# EAGLE design PR9014 (EAGLE 7.2.0)
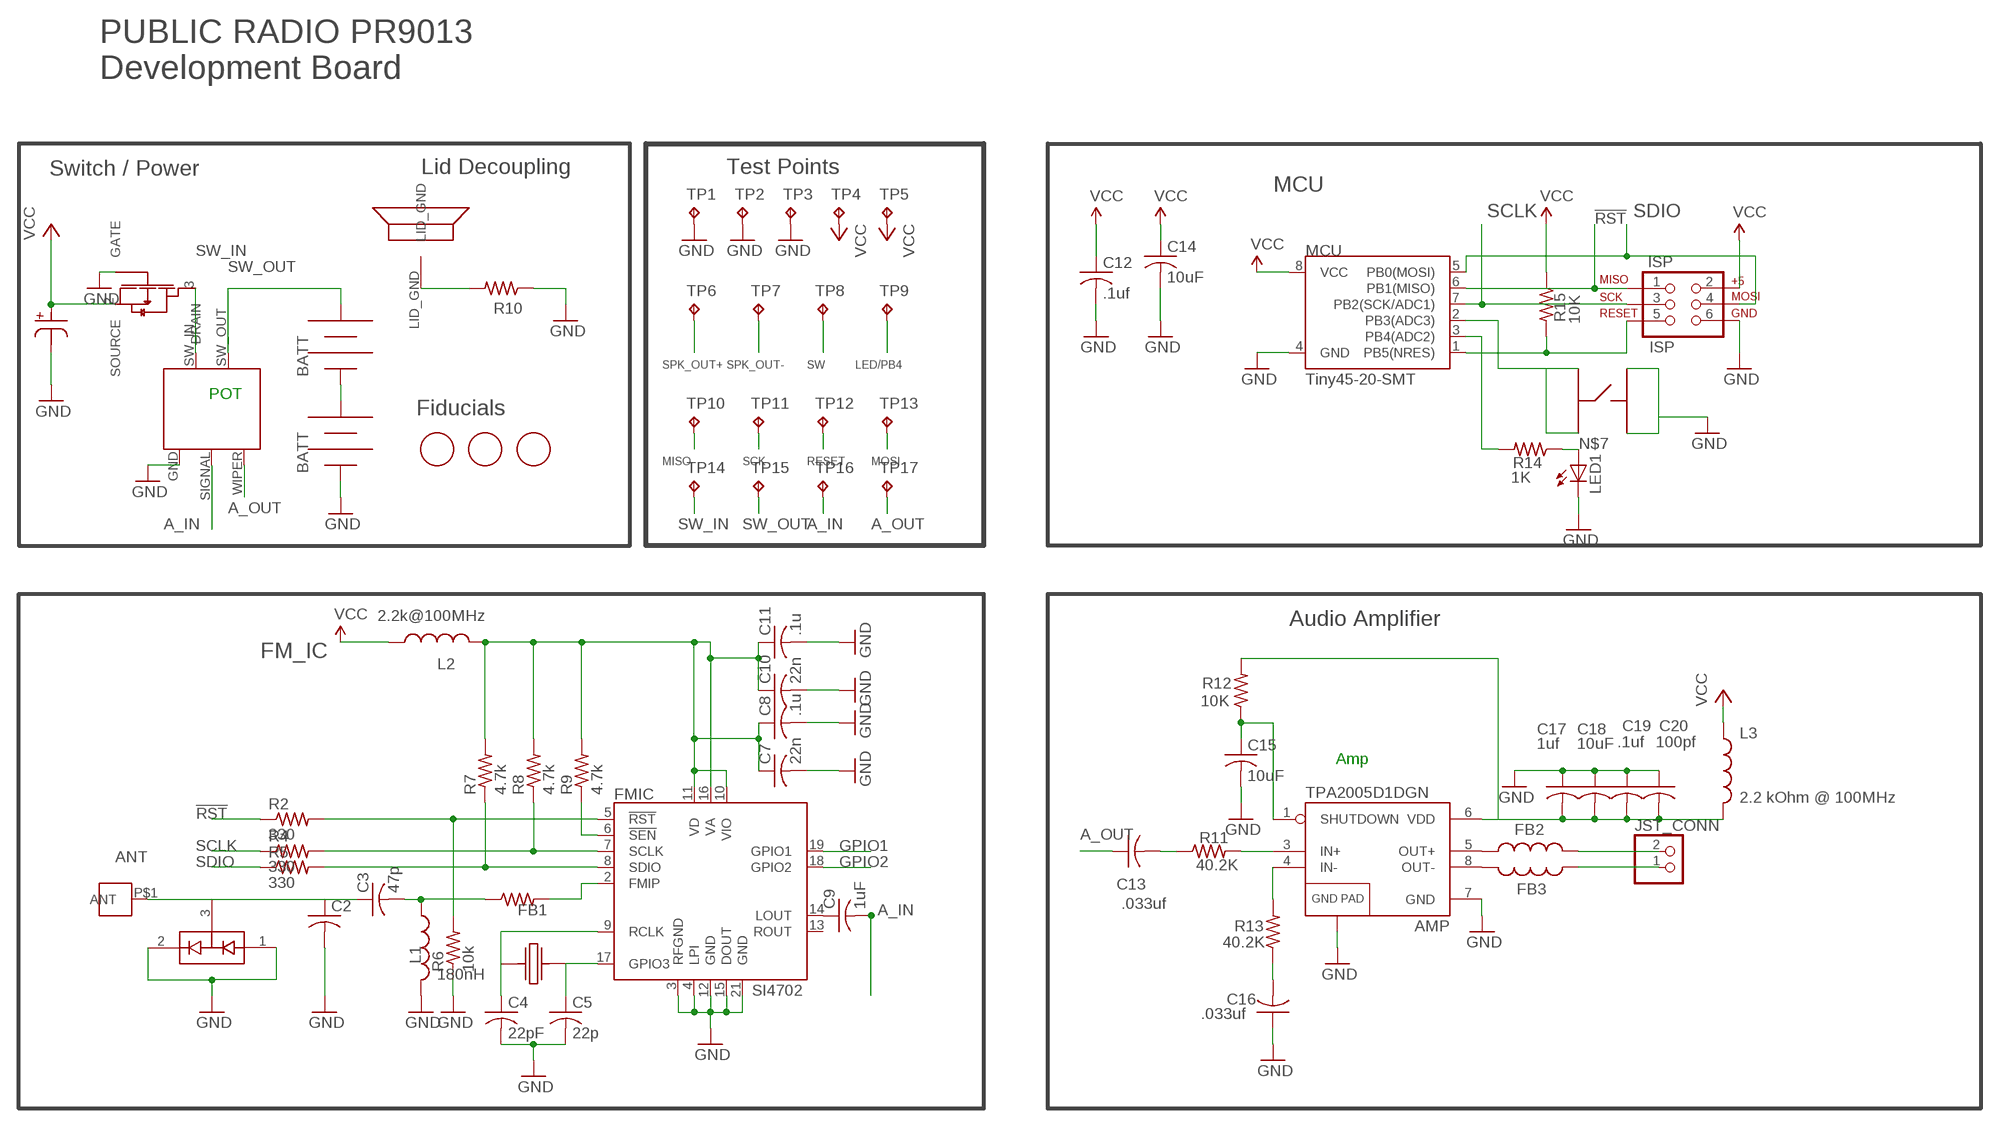
[diagram p0: schematic, sheet 1]

## Parts
AMP  TPA2005D1DGN  [POWER-SOP8]
C1  220uF  NICHICON_SERIESUD  [NICHICON_SERIESUD]
C2  C-USC0402  [C0402]
C3  47p  C-USC0402  [C0402]
C4  22pF  C-USC0402  [C0402]
C5  22p  C-USC0402  [C0402]
C7  22n  C-USC0402  [C0402]
C8  .1u  C-USC0402  [C0402]
C9  1uF  C-USC0402  [C0402]
C10  22n  C-USC0402  [C0402]
C11  .1u  C-USC0402  [C0402]
C12  .1uf  C-USC0402  [C0402]
C13  .033uf  C-USC0402  [C0402]
C14  10uF  C-USC0603  [C0603]
C15  10uF  C-USC0603  [C0603]
C16  .033uf  C-USC0402  [C0402]
C17  1uf  C-USC0402  [C0402]
C18  10uF  C-USC0603  [C0603]
C19  .1uf  C-USC0402  [C0402]
C20  100pf  C-USC0402  [C0402]
D1  BAV99  [SOT23]
FB1  R-US_R0402  [R0402]
FB2  INDUCTOR0805  [0805]
FB3  INDUCTOR0805  [0805]
FET2  AO3435  [AO3435]
FMIC  SI4702  SI470X  [SI470X]
ISP  ISP  AVR_SPI_PRG_6NS  [2X3-NS]
J1  M3_SCREW_POST  [M3_SCREW_POST]
JP5  BK-92_MPD_AA_BATT_CLIP  [BK-92_MPD_AA_BATT_CLIP]
JP6  BK-92_MPD_AA_BATT_CLIP  [BK-92_MPD_AA_BATT_CLIP]
JST_CONN  JST_2PIN-SMT-RA  [JST-PH-2-SMT-RA]
L1  180nH  INDUCTOR0805  [0805]
L2  2.2k@100MHz  INDUCTOR0402  [C0402]
L3  2.2 kOhm @ 100MHz  INDUCTOR0402  [C0402]
LED1  LEDSML0603  [SML0603]
MCU  Tiny45-20-SMT  ATTINY45TINY85-20-SMT  [SO08-EIAJ]
R1  RV170SF_TAIWANA_POT_SW  [RV170SF_TAIWANA_POT_SW]
R2  330  R-US_R0402  [R0402]
R4  330  R-US_R0402  [R0402]
R5  330  R-US_R0402  [R0402]
R6  10k  R-US_R0402  [R0402]
R7  4.7k  R-US_R0402  [R0402]
R8  4.7k  R-US_R0402  [R0402]
R9  4.7k  R-US_R0402  [R0402]
R10  R-US_R0805  [R0805]
R11  40.2K  R-US_R0402  [R0402]
R12  10K  R-US_R0402  [R0402]
R13  40.2K  R-US_R0402  [R0402]
R14  1K  R-US_R0402  [R0402]
R15  10K  R-US_R0402  [R0402]
SW1  C&K_PTS645  [C&K_TACTILE_SWITCH]
TP1  TPTP20R  [TP20R]
TP2  TPTP20R  [TP20R]
TP3  TPTP20R  [TP20R]
TP4  TPTP20R  [TP20R]
TP5  TPTP20R  [TP20R]
TP6  TPTP20R  [TP20R]
TP7  TPTP20R  [TP20R]
TP8  TPTP20R  [TP20R]
TP9  TPTP20R  [TP20R]
TP10  TPTP20R  [TP20R]
TP11  TPTP20R  [TP20R]
TP12  TPTP20R  [TP20R]
TP13  TPTP20R  [TP20R]
TP14  TPTP20R  [TP20R]
TP15  TPTP20R  [TP20R]
TP16  TPTP20R  [TP20R]
TP17  TPTP20R  [TP20R]
U$1  CE32A_FOR_JST  [CE32A_FOR_JST]
U$3  FIDUCIAL  [FIDUCIAL_1MM]
U$4  FIDUCIAL  [FIDUCIAL_1MM]
U$5  FIDUCIAL  [FIDUCIAL_1MM]
U$6  ABS25XTAL  [ABS25XTAL]

## Nets
3.3V: C7.1 C8.1 C10.1 C11.1 FMIC.10(VIO) FMIC.11(VD) FMIC.16(VA) L2.2 R7.2 R8.2 R9.2
!RST: ISP.1 MCU.6(PB1(MISO)) R2.1 TP10.TP
!RST-L: FMIC.5(!RST) R2.2 R6.2
!SEN-L: FMIC.6(!SEN) R9.1
A_IN: C9.2 R1.SIGNAL TP16.TP
A_OUT: C13.1 R1.WIPER TP17.TP
ANT [antenna]: C2.1 C3.1 D1.3(COM) J1.P$1(ANT)
GND: AMP.7(GND) AMP.9(GND) C1.P$2 C2.2 C4.2 C5.2 C7.2 C8.2 C10.2 C11.2 C12.2 C14.2 C15.2 C16.1 C17.1 C18.1 C19.1 C20.1 D1.1(A1) D1.2(C2) FET2.1(GATE) FMIC.3(RFGND) FMIC.4(LPI) FMIC.12(GND) FMIC.15(DOUT) FMIC.21(GND) ISP.6 JP6.NEG JP6.NEG@2(NEG) L1.2 LED1.C MCU.4(GND) R1.GND R6.1 R10.1 SW1.P$1 SW1.P$2 TP1.TP TP2.TP TP3.TP
GPIO1: FMIC.19(GPIO1)
GPIO2: FMIC.18(GPIO2)
LED/PB4: MCU.3(PB4(ADC2)) R14.2 TP9.TP
N$1: C4.1 FMIC.9(RCLK) U$6.P$1
N$3: C13.2 R11.1
N$4: AMP.3(IN+) R11.2
N$5: AMP.4(IN-) R13.2
N$6: FB1.2 FMIC.2(FMIP)
N$7: LED1.A R14.1
N$8: R10.2 U$1.LID_GND
N$9: C9.1 FMIC.14(LOUT)
N$10: C5.1 FMIC.17(GPIO3) U$6.P$4
N$13: JP5.NEG JP5.NEG@2(NEG) JP6.POS JP6.POS@2(POS)
N$16 [antenna]: C3.2 FB1.1 L1.1
N$17: AMP.8(OUT-) FB3.2
N$18: AMP.6(VDD) C17.2 C18.2 C19.2 C20.2 L3.2 R12.2
N$19: AMP.5(OUT+) FB2.1
N$20: AMP.1(SHUTDOWN) C15.1 R12.1
N$23: C16.2 R13.1
RESET: ISP.5 MCU.1(PB5(NRES)) R15.2 TP12.TP
SCLK: ISP.3 MCU.7(PB2(SCK/ADC1)) R4.1 TP11.TP
SCLK-L: FMIC.7(SCLK) R4.2 R8.1
SDIO: ISP.4 MCU.5(PB0(MOSI)) R5.1 TP13.TP
SDIO-L: FMIC.8(SDIO) R5.2 R7.1
SPK_OUT+: FB2.2 JST_CONN.2 TP6.TP
SPK_OUT-: FB3.1 JST_CONN.1 TP7.TP
SW: MCU.2(PB3(ADC3)) SW1.P$3 SW1.P$4 TP8.TP
SW_IN: FET2.3(DRAIN) R1.SW_IN TP14.TP
SW_OUT: JP5.POS JP5.POS@2(POS) R1.SW_OUT TP15.TP
VCC: C1.P$1 C12.1 C14.1 FET2.2(SOURCE) ISP.2 L2.1 L3.1 MCU.8(VCC) R15.1 TP4.TP TP5.TP
Unconnected: FMIC.13(ROUT)

## Notes on the sheet
- PUBLIC RADIO PR9013
  Development Board
- Switch / Power | Lid Decoupling | Test Points
- MCU
- POT
- Fiducials
- MISO | SCK | RESET | MOSI
- Audio Amplifier
- FM_IC
- Amp

## Library data of the parts
AMP = PR_Parts_Library:TPA2005D1: 1.4W MONO CLASS-D AUDIO POWER AMPLIFIER The TPA2005D1 is a 1.4-W high efficiency filter-free class-D audio power amplifier in a BGA, QFN, or MSOP package that requires only three external components. Datasheet: http://focus.ti.com/lit/ds/symlink/tpa2005d1.pdf 1.4 W Into 8 ? From a 5V Supply at THD = 10% (Typ) Maximum Battery Life and Minimum Heat Efficiency With an 8-? Speaker: 84% at 400 mW, 79% at 100 mW 2.8-mA Quiescent Current 0.5-mA Shutdown Current Ideal for Wireless or Cellular Handsets and PDAs Capable of Driving an 8-? Speaker (2.5 V ? VDD ? 5.5 V) and a 4-? Speaker (2.5 V ? VDD ? 4.2 V) Only Three External Components Optimized PWM Output Stage Eliminates LC Output Filter Internally Generated 250-kHz Switching Frequency Eliminates Capacitor and Resistor Improved PSRR (-71 dB at 217 Hz) and Wide Supply Voltage (2.5 V to 5.5 V) Eliminates Need for a Voltage Regulator Fully Differential Design Reduces RF Rectification and Eliminates Bypass Capacitor Improved CMRR Eliminates Two Input Coupling Capacitors
C1 = PR_Parts_Library:NICHICON_SERIESUD: Nichicon UD Series 220uf Cap MFG# UUD1C221MCL1GS
C2-C5 C7-C20 = resistor:C-US: CAPACITOR, American symbol
D1 = SparkFun-DiscreteSemi:BAV99: Two small signal silicon diodes connected anode to cathode. Connections to all three nodes available. DIO-10647; PROD_ID: DIO-10647
FB1 R2 R4-R15 = resistor:R-US_: RESISTOR, American symbol
FB2 FB3 L1-L3 = SparkFun-Passives:INDUCTOR: Inductors Basic Inductor/Choke - 0603 and 1206. Footprints are not proven and vary greatly between part numbers.
FET2 = PR_Parts_Library:AO3435: MOSFET P-CH 20V 2.9A SOT23 MFG # AO3435
FMIC = PR_Parts_Library:SI470X: SI4702-C19-GMR
ISP = SparkFun-Connectors:AVR_SPI_PRG_6: AVR ISP 6 Pin This is the reduced ISP connector for AVR programming. Common on Arduino. This footprint will take up less PCB space and can be used with a 10-pin to 6-pin adapter such as SKU: BOB-08508
J1 = PR_Parts_Library:M3_SCREW_POST
JP5 JP6 = PR_Parts_Library:BK-92_MPD_AA_BATT_CLIP
JST_CONN = adafruit:JST_2PIN: JST 2-Pin Connectors of various flavors SMT-RA (S2B-PH-SM4) 4UConnector #17311 SMT (B2B-PH-SM4) THM-RA (S2B-PH) THM (B2B-PH)
LED1 = led:LED: LED OSRAM: - CHIPLED LG R971, LG N971, LY N971, LG Q971, LY Q971, LO R971, LY R971 LH N974, LH R974 LS Q976, LO Q976, LY Q976 LO Q996 - Hyper CHIPLED LW Q18S LB Q993, LB Q99A, LB R99A - SideLED LS A670, LO A670, LY A670, LG A670, LP A670 LB A673, LV A673, LT A673, LW A673 LH A674 LY A675 LS A676, LA A676, LO A676, LY A676, LW A676 LS A679, LY A679, LG A679 - Hyper Micro SIDELED® LS Y876, LA Y876, LO Y876, LY Y876 LT Y87S - SmartLED LW L88C, LW L88S LB L89C, LB L89S, LG L890 LS L89K, LO L89K, LY L89K LS L896, LA L896, LO L896, LY L896 - TOPLED LS T670, LO T670, LY T670, LG T670, LP T670 LSG T670, LSP T670, LSY T670, LOP T670, LYG T670 LG T671, LOG T671, LSG T671 LB T673, LV T673, LT T673, LW T673 LH T674 LS T676, LA T676, LO T676, LY T676, LB T676, LH T676, LSB T676, LW T676 LB T67C, LV T67C, LT T67C, LS T67K, LO T67K, LY T67K, LW E67C LS E67B, LA E67B, LO E67B, LY E67B, LB E67C, LV E67C, LT E67C LW T67C LS T679, LY T679, LG T679 LS T770, LO T770, LY T770, LG T770, LP T770 LB T773, LV T773, LT T773, LW T773 LH T774 LS E675, LA E675, LY E675, LS T675 LS T776, LA T776, LO T776, LY T776, LB T776 LHGB T686 LT T68C, LB T68C - Hyper Mini TOPLED® LB M676 - Mini TOPLED Santana® LG M470 LS M47K, LO M47K, LY M47K Source: http://www.osram.convergy.de LUXEON: - LUMILED® LXK2-PW12-R00, LXK2-PW12-S00, LXK2-PW14-U00, LXK2-PW14-V00 LXK2-PM12-R00, LXK2-PM12-S00, LXK2-PM14-U00 LXK2-PE12-Q00, LXK2-PE12-R00, LXK2-PE12-S00, LXK2-PE14-T00, LXK2-PE14-U00 LXK2-PB12-K00, LXK2-PB12-L00, LXK2-PB12-M00, LXK2-PB14-N00, LXK2-PB14-P00, LXK2-PB14-Q00 LXK2-PR12-L00, LXK2-PR12-M00, LXK2-PR14-Q00, LXK2-PR14-R00 LXK2-PD12-Q00, LXK2-PD12-R00, LXK2-PD12-S00 LXK2-PH12-R00, LXK2-PH12-S00 LXK2-PL12-P00, LXK2-PL12-Q00, LXK2-PL12-R00 Source: www.luxeon.com KINGBRIGHT: KA-3528ASYC Source: www.kingbright.com
MCU = SparkFun-DigitalIC:ATTINY45: Atmel 8-pin 2/4/8kB flash uC; PROD_ID: IC-09092; VALUE: Tiny85-20-SMT
R1 = PR_Parts_Library:RV170SF_TAIWANA_POT_SW
SW1 = PR_Parts_Library:C&K_PTS645: 6MM Tactile Switch MFG# PTS645SM43SMTR92 LFS
TP1-TP17 = testpad:TP: Test pad
U$1 = PR_Parts_Library:CE32A_FOR_JST: This package allows one of the speaker screws to be used as a ground terminal for The Public Radio's lid.
U$3-U$5 = adafruit:FIDUCIAL: For use by pick and place machines to calibrate the vision/machine, 1mm By microbuilder.eu
U$6 = PR_Parts_Library:ABS25XTAL: 4PIN 32.768 Xtal MFG# ABS25-32.768KHZ-T

## Net classes
1 antenna: clearance 1.27 mm

## Board
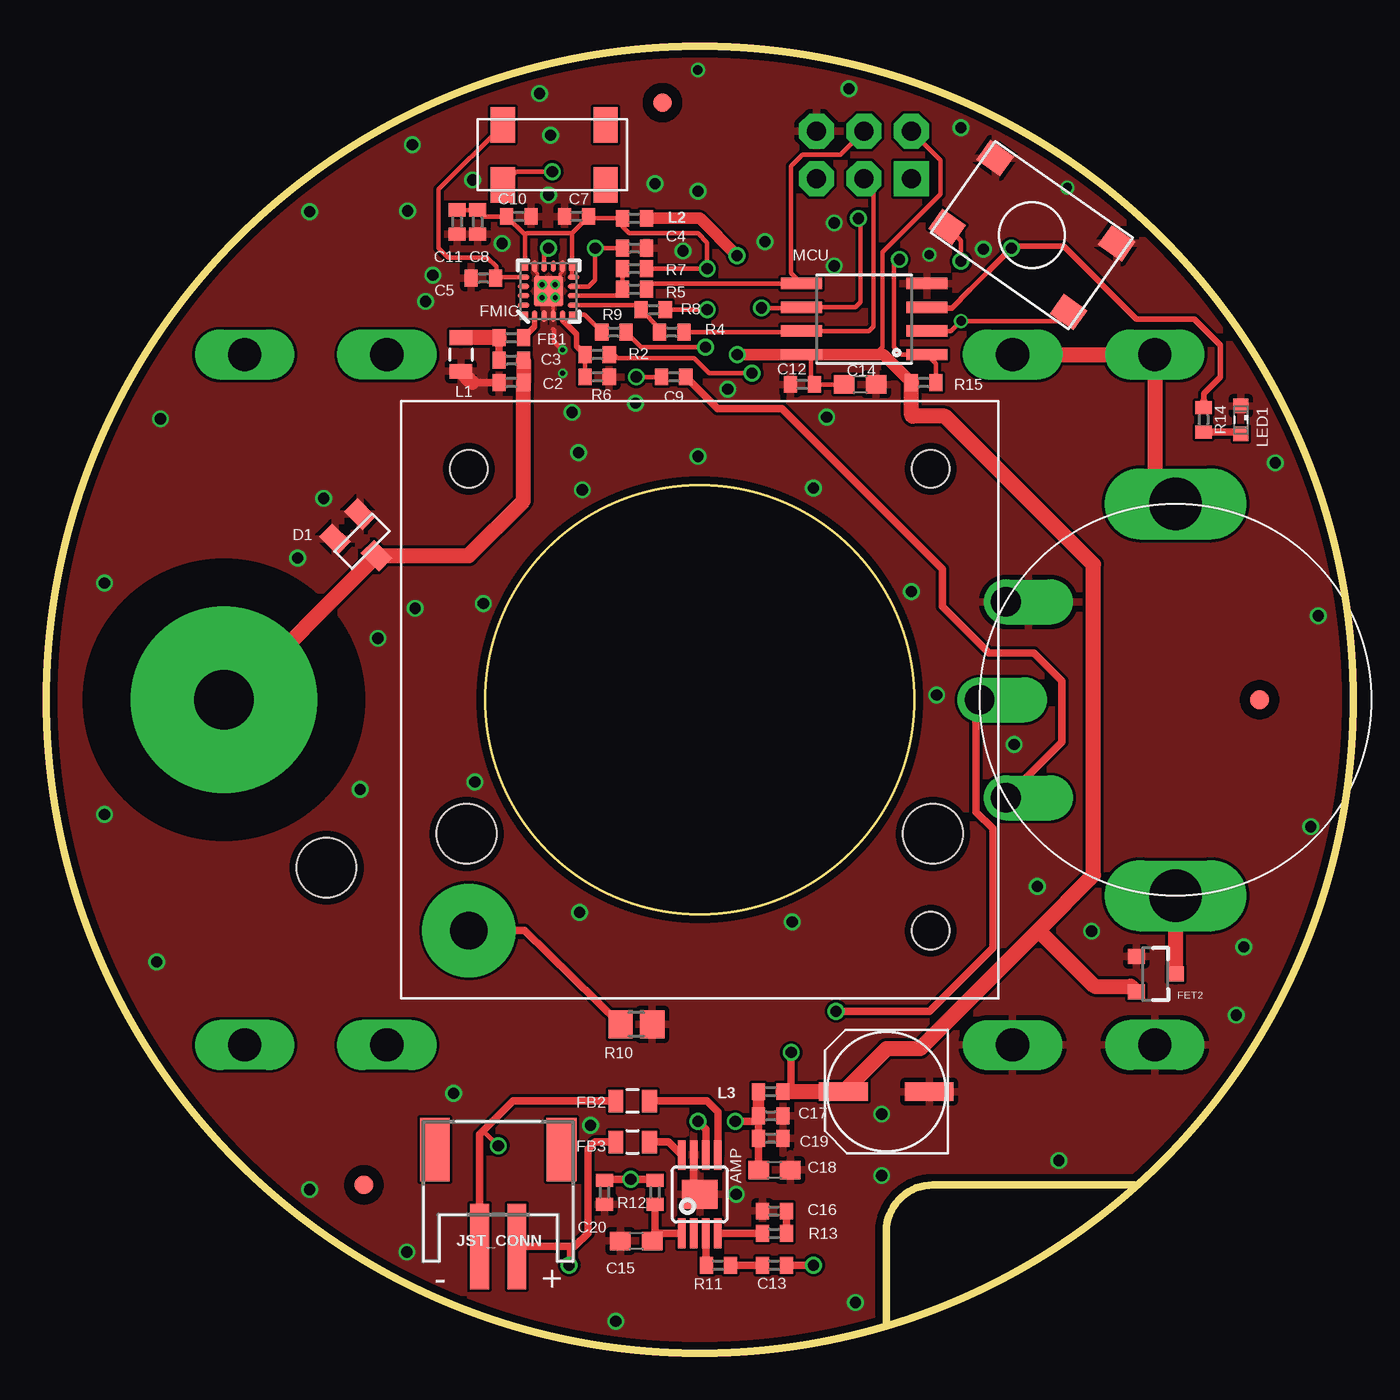
[diagram p1: board, top side]
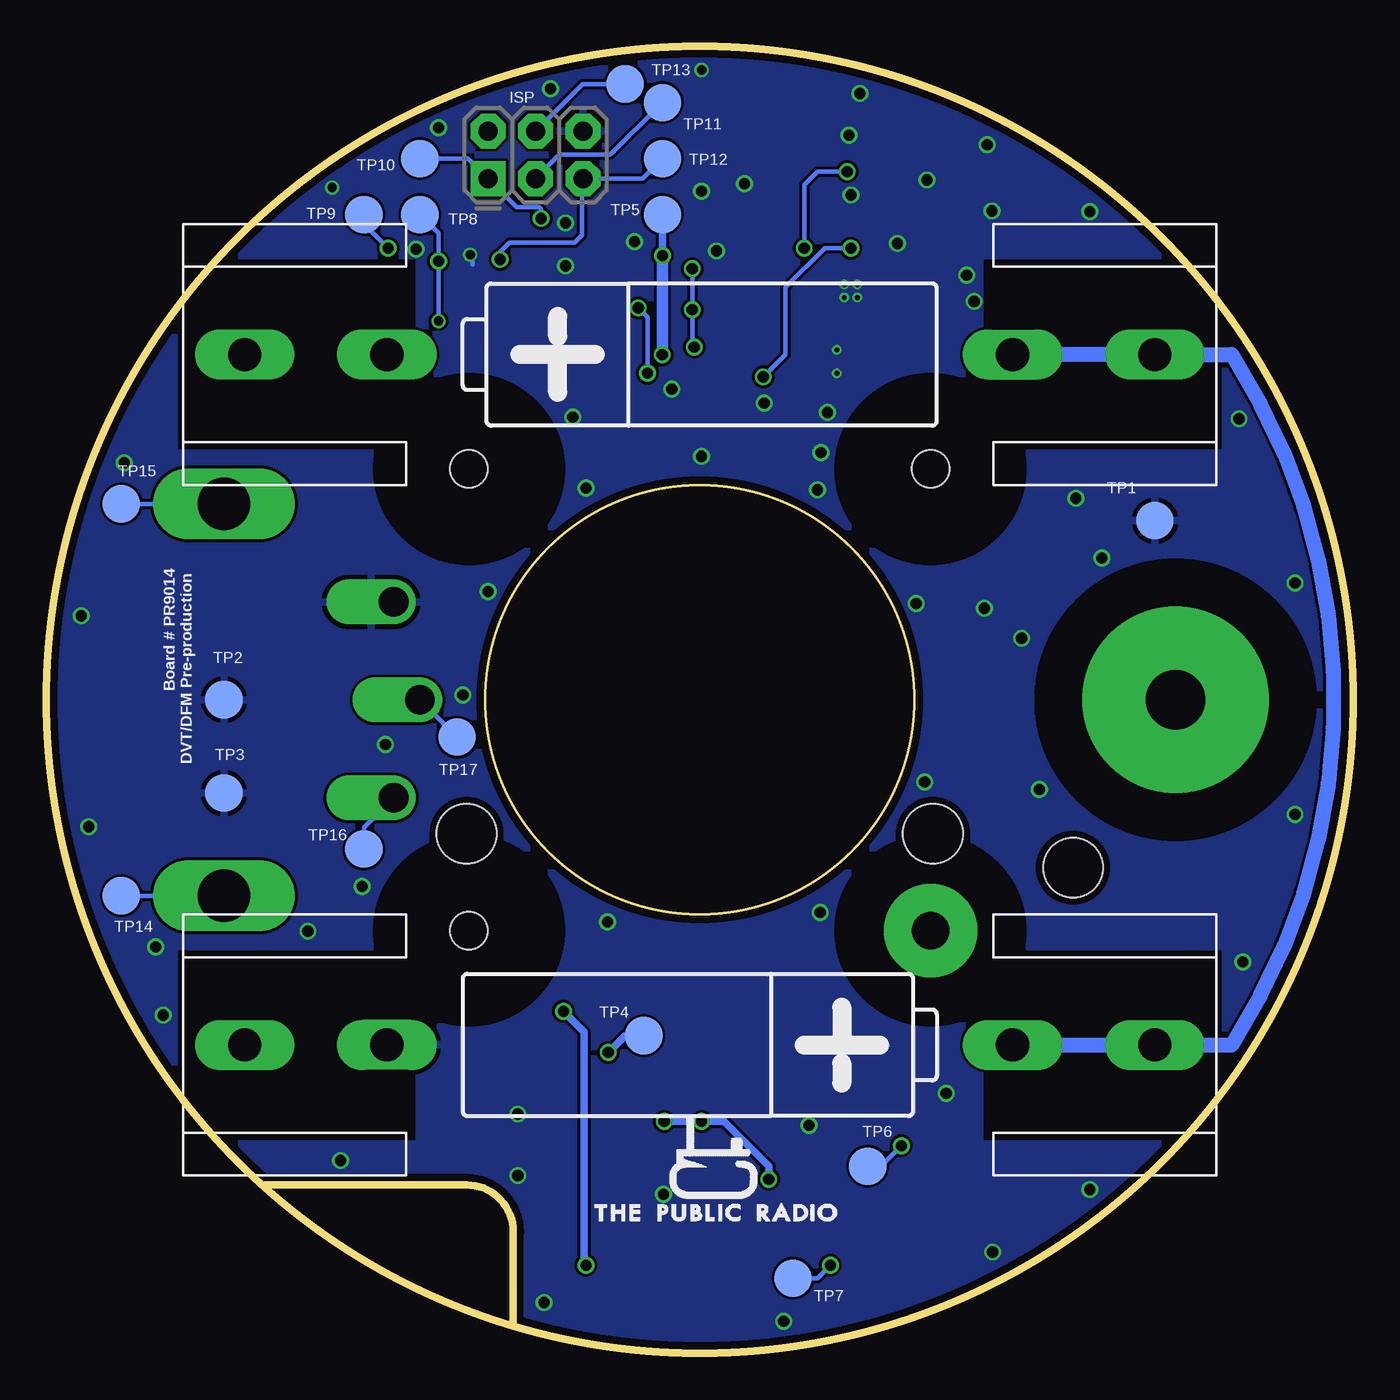
[diagram p2: board, bottom side, seen from below]

Size 70 x 70 mm. Coordinates in mm from the lower left corner, seen from the top.
Outline: 45,1.5 45,6.5 arc-90 47.5,9 58.3,9
Outline: circle at 35,35 radius 35
Copper layers (1*16): Top 0.0356mm / dielectric 1.5011mm / Bottom 0.0356mm
Design rules "LaenPCBOrder *": minimum track width 6mil, minimum drill 13mil, track to track 6mil, track to pad 6mil, pad to pad 6mil, via to via 6mil, smd to smd 6mil, copper to edge 15mil, drill to drill 6mil, minimum pad ring 7mil, minimum via ring 5mil, stop-mask expansion 3mil, vias tented up to drill 0mil, thermal gap 10mil
Holes 3.2 mm at 15,26
tRestrict: area 26.1,56.1 to 27.7,57.7; 8 lines

### Footprints (pad centres in the part's own frame; a part is rotated, then mirrored left to right if it is on the bottom)
POWER-SOP8 = smd 0.4 x 1.6: 1 -0.975,-2.1; 2 -0.325,-2.1; 3 0.325,-2.1; 4 0.975,-2.1; 5 0.975,2.1; 6 0.325,2.1; 7 -0.325,2.1; 8 -0.975,2.1 | smd 1.89 x 1.57: 9 0,0
NICHICON_SERIESUD = smd 1 x 2.6: P$1 0,2.3; P$2 0,-2.3
C0402 = smd 0.7 x 0.9: 1 -0.65,0; 2 0.65,0
C0603 = smd 1.1 x 1: 1 -0.85,0; 2 0.85,0
SOT23 = smd 1 x 1.4: 1 -0.95,-1.1; 2 0.95,-1.1; 3 0,1.1
R0402 = smd 0.7 x 0.9: 1 -0.65,0; 2 0.65,0
0805 = smd 0.8 x 1.2: 1 -0.9,0; 2 0.9,0
AO3435 = smd 0.8 x 0.9: 1 -0.95,-1; 2 0.95,-1; 3 0,1.1
SI470X = smd 0.34 x 0.34: 1 -1.275,1.265; 6 -1.265,-1.265; 11 1.265,-1.265; 16 1.265,1.265 | smd 0.61 x 0.28: 2 -1.335,0.75; 3 -1.335,0.25; 4 -1.335,-0.25; 5 -1.335,-0.75; 12 1.335,-0.75; 13 1.335,-0.25; 14 1.335,0.25; 15 1.335,0.75 | smd 0.28 x 0.61: 7 -0.75,-1.335; 8 -0.25,-1.335; 9 0.25,-1.335; 10 0.75,-1.335; 17 0.75,1.335; 18 0.25,1.335; 19 -0.25,1.335; 20 -0.75,1.335 | smd 1.6 x 1.6: 21 0,0
2X3-NS = drill 1.016 pad 1.88 square: 1 -2.54,-1.27 | drill 1.016 pad 1.88 octagon: 2 -2.54,1.27; 3 0,-1.27; 4 0,1.27; 5 2.54,-1.27; 6 2.54,1.27
M3_SCREW_POST = drill 3.2 pad 10: P$1 0,0
BK-92_MPD_AA_BATT_CLIP = drill 1.778 long: NEG -24.384,0; NEG@2 -16.764,0; POS 16.764,0; POS@2 24.384,0
JST-PH-2-SMT-RA = smd 1 x 4.6: 1 1,-3.7; 2 -1,-3.7 | smd 1.6 x 3.4: NC1 -3.4,1.5; NC2 3.4,1.5
SML0603 = smd 0.8 x 0.8: A 0.75,0; C -0.75,0
SO08-EIAJ = smd 0.61 x 2.21: 1 -1.905,-3.378; 2 -0.635,-3.378; 3 0.635,-3.378; 4 1.905,-3.378; 5 1.905,3.353; 6 0.635,3.353; 7 -0.635,3.353; 8 -1.905,3.353
RV170SF_TAIWANA_POT_SW = drill 1.6 offset: GND -5.25,-9.09; SIGNAL 5.25,-9.09; WIPER 0,-10.5 | drill 2.8 long: SW_IN 10.5,0; SW_OUT -10.5,0
R0805 = smd 1.3 x 1.5: 1 -0.85,0; 2 0.85,0
C&K_TACTILE_SWITCH = smd 1.55 x 1.3: P$1 -3.975,2.25; P$2 3.975,2.25; P$3 -3.975,-2.25; P$4 3.975,-2.25
TP20R = smd 2 x 2: TP 0,0
CE32A_FOR_JST = drill 2 pad 5: LID_GND -12.37,-12.37 | hole 2: -12.37,12.37; 12.37,12.37; 12.37,-12.37 | hole 3.2: -12.497,-7.188; 12.497,-7.188
FIDUCIAL_1MM = smd 1 x 1: 1 0,0
ABS25XTAL = smd 1.3 x 1.9: P$1 -2.75,-1.6; P$2 2.75,-1.6; P$3 2.75,1.6; P$4 -2.75,1.6

### Placement (x,y rotation side)
AMP  35,8.5 0 top
C1  45,14 90 top
C2  24.9,52 180 top
C3  24.9,53.2 180 top
C4  31.5,59.2 0 top
C5  23.4,57.6 180 top
C7  28.4,60.9 180 top
C8  23.1,60.6 270 top
C9  33.6,52.3 0 top
C10  25.3,60.9 0 top
C11  22,60.6 270 top
C12  40.5,51.9 180 top
C13  39,4.7 180 top
C14  43.6,51.9 0 top
C15  31.6,6 180 top
C16  39,7.6 0 top
C17  38.8,12.7 180 top
C18  39,9.8 180 top
C19  38.8,11.5 180 top
C20  29.9,8.6 90 top
D1  16.9,43.5 225 top
FB1  24.9,54.4 0 top
FB2  31.4,13.5 180 top
FB3  31.4,11.3 0 top
FET2  59.4,20.3 270 top
FMIC  26.9,56.9 90 top
ISP  43.8,64.2 0 bottom
J1  9.5,35 0 top
JP5  35,53.5 180 bottom
JP6  35,16.5 0 bottom
JST_CONN  24.2,9.4 0 top
L1  22.2,53.5 270 top
L2  31.5,60.8 180 top
L3  38.8,14 180 top
LED1  64,50 270 top
MCU  43.8,55.4 90 top
R1  60.5,35 270 top
R2  29.5,53.5 180 top
R4  33.5,54.7 180 top
R5  31.5,57 180 top
R6  29.5,52.3 180 top
R7  31.5,58.1 0 top
R8  32.5,55.9 0 top
R9  30.4,54.7 0 top
R10  31.6,17.6 180 top
R11  36,4.7 180 top
R12  32.6,8.6 90 top
R13  39,6.4 180 top
R14  62,50 90 top
R15  47,52 0 top
SW1  52.8,59.9 325 top
TP1  10.6,44.6 0 bottom
TP2  60.5,35 0 bottom
TP3  60.5,30 0 bottom
TP4  38,17 0 bottom
TP5  37,61 0 bottom
TP6  26,10 0 bottom
TP7  30,4 0 bottom
TP8  50,61 0 bottom
TP9  53,61 0 bottom
TP10  50,64 0 bottom
TP11  37,67 0 bottom
TP12  37,64 0 bottom
TP13  39,68 0 bottom
TP14  66,24.5 0 bottom
TP15  66,45.5 0 bottom
TP16  53,27 0 bottom
TP17  48,33 0 bottom
U$1  35,35 0 top
U$3  17,9 0 top
U$4  33,67 0 top
U$5  65,35 0 top
U$6  27.2,64.2 0 top

### Tracks (layer width: path | path; a pad name or v marks a point on that pad's centre or on a via)
3.3V  (via drill 0.6)
  Top 0.254: FMIC.10 28.16,57.72 FMIC.11 28.16,60.02 | 34.35,58.1 R7.2 v35.4,58.1 35.4,59.5 34.9,60 31.2,60 30.85,60.35 L2.2 29.15,60.8 C7.1 28.16,60.02 | R9.2 31.85,53.9 v35.3,53.9 | FMIC.16 25.64,59.91 | 25.64,59.91 C10.1 23.45,60.9 C8.1 C11.1 | 28.16,60.02 25.73,60.02 25.64,59.91 | R8.2 v35.4,55.9
  Bottom 0.254: v35.3,53.9 35.4,54 v35.4,55.9 v35.4,58.1
!RST  (via drill 0.6)
  Top 0.254: MCU.6 41,56.03 | 41,56.03 43.34,56.03 43.6,56.3 43.6,60.7 v43.5,60.8 | v38.3,56 40.97,56 41,56.03 | R2.1 30.4,53.5 30.6,53.3 34.7,53.3 35.5,52.5 v37.8,52.5
  Bottom 0.254: v43.5,60.8 43.5,61.3 43.6,61.4 44.81,61.4 ISP.1 47.41,64 TP10.TP | v37.8,52.5 37.8,55.5 v38.3,56
!RST-L
  Top 0.254: R6.2 R2.2
  Top 0.305: FMIC.5 27.65,55.35 28.4,54.6 28.4,53.95 R2.2
!SEN-L
  Top 0.254: FMIC.6 28.82,55.63 R9.1
A_IN
  Top 0.406: R1.SIGNAL 54.4,32.74 54.4,36 52.9,37.5 50.5,37.5 48,40 48,42 39.4,50.6 35.95,50.6 C9.2
  Bottom 0.254: TP16.TP 53,28.16 R1.SIGNAL
A_OUT  (via drill 0.6)
  Top 0.406: R1.WIPER 49.8,34.8 49.8,29 50.7,28.1 50.7,21.7 47.3,18.3 v42.3,18.3 | C13.1 v41.1,4.7
  Bottom 0.254: TP17.TP R1.WIPER
  Bottom 0.406: v42.3,18.3 41.2,17.2 41.2,4.8 v41.1,4.7
ANT
  Top 0.813: J1.P$1 9.96,35 D1.3 22.62,42.72 25.55,45.65 C2.1 C3.1
GND  (via drill 0.25, 0.25 pad 0.1, 0.5, 0.6)
  Top 0.2: FMIC.12 27.65,57.95 27.5,57.8 27.5,57.5 v27.25,57.25 | 26.34,57.46 v26.55,57.25 26.31,57.49 26.31,57.84 26.15,58 FMIC.15 | FMIC.4 27.15,56.44 v27.26,56.55
  Top 0.254: C10.2 26.05,60.8 | 27.15,54.85 27.2,54.8 27.2,54.2 v27.65,53.75 | v27.25,57.25 FMIC.21 | v26.55,57.25 v26.55,57.24 26.57,57.23
  Top 0.406: AMP.7 34.67,8.82 AMP.9 | C2.2 22.8,52
  Top 0.813: 22.8,52 L1.2
  Bottom 0.254: 47.18,58.84 47.18,58.33
  other vias: 34.9,68.75 31.55,50.9 65.85,47.7 28.7,46.25 26.41,67.49 53.1,25 46.35,40.8 43.35,2.7 19.3,5.4 21.8,13.9 28.55,23.6 39.95,23.1 64.15,21.75 51.85,32.6 26.9,62.05 19.6,64.75 47.3,58.85 43,67.75 49,65.65 41.1,46.35 36.95,8.5 29.15,12.2 44.75,12.8 41.8,50.15 56,22.6 54.7,62.45 38.5,59.55 47.7,35.25 20.7,57.75 26.55,56.55 27,65.25 42.2,60.55 42.2,58.25 32.6,62.65 34.1,59.05 24.4,59.45 22.83,62.85 36.5,51.65 50.2,59.15 14.1,61.15 6.1,50.05 3.1,41.25 3.1,28.85 14.1,8.75 30.5,1.7 44.75,9.5 54.25,10.3 63.75,18.1 67.75,28.2 68.15,39.5 27.65,52.5 19.35,61.2 28.15,50.4 19.75,39.9 23.4,40.15 22.95,30.6 34.9,48.05 20.3,56.35 16.8,30.2 5.9,20.95 34.9,62.25 28.5,48.25 17.75,38.3 13.45,42.6 14.85,45.8
  pour Bottom: 0,35 arc90 35,0 arc90 70,35 arc90 35,70 arc90
  pour Top: 0,35 arc90 35,0 arc90 70,35 arc90 35,70 arc90
LED/PB4  (via drill 0.6)
  Top 0.254: 50.5,58 49.45,56.95 | 47.34,56.2 MCU.3
  Top 0.305: 50.5,58 v51.7,59.2 51.8,59.3 54.5,59.3 58.4,55.4 61.5,55.4 62.9,54 62.9,52.3 62,51.4 62,51 | 49.45,56.95 48.5,56 47.21,56 MCU.3
  Top 0.406: R14.2 62,51
  Bottom 0.254: TP9.TP 53,60.5 v51.7,59.2
N$1  (via drill 0.6)
  Top 0.254: C4.1 v29.4,59.2 29.4,57.5 29.05,57.15 FMIC.9 | v27.1,63.3 25.15,63.3 U$6.P$1
  Bottom 0.254: v29.4,59.2 29.4,62.6 28.7,63.3 v27.1,63.3
N$3
  Top 0.406: R11.1 C13.2
N$4
  Top 0.406: AMP.3 35.33,4.72 R11.2
N$5
  Top 0.406: AMP.4 R13.2
N$6
  Top 0.305: FMIC.2 26.15,55 FB1.2
N$7
  Top 0.406: R14.1 63.9,49.35 LED1.A
N$8
  Top 0.406: R10.2 25.62,22.63 U$1.LID_GND
N$9  (via drill 0.6)
  Top 0.254: C9.1 v31.6,52.3 | FMIC.14 26.65,58.95 v26.9,59.2
  Bottom 0.254: v26.9,59.2 28.3,59.2 30.4,57.1 30.4,53.5 v31.6,52.3
N$10
  Top 0.254: FMIC.17 24.1,57.65 | 24.1,57.65 C5.1 | 24.1,57.65 24.1,58.2 23.6,58.7 21.5,58.7 21,59.2 21,62.35 U$6.P$4
N$13
  Bottom 0.813: JP6.POS JP6.POS@2 6.5,16.5 arc-66 6.5,53.5 JP5.NEG JP5.NEG@2
N$16
  Top 0.406: FB1.1 C3.2
  Top 0.813: FB1.1 L1.1
N$17
  Top 0.406: AMP.8 33.33,11.3 FB3.2
N$18  (via drill 0.6, 0.6 pad 0.41)
  Top 0.406: AMP.6 35.33,11.97 v34.9,12.4 | v36.9,12.4 37.85,12.4 C17.2 C19.2 C18.2 | R12.2 32.55,9.3 v31.3,9.3 29.95,9.3 C20.2
  Top 0.61: C17.2 L3.2
  Bottom 0.406: v36.9,12.4 v34.9,12.4 33.7,12.4 31.3,10 v31.3,9.3
N$19
  Top 0.406: AMP.5 35.98,12.93 35.4,13.5 FB2.1
N$20
  Top 0.406: AMP.1 32.85,6.4 32.6,6.15 | R12.1 32.6,6.15 | 32.6,6.15 C15.1
N$21
  pour Bottom: 
N$23
  Top 0.406: R13.1 C16.2
RESET  (via drill 0.6)
  Top 0.254: R15.2 47.65,53.02 MCU.1 45.8,53.49 45.4,53.9 45.4,58.3 v45.7,58.6
  Bottom 0.254: v45.7,58.6 45.7,59 45.2,59.5 41.7,59.5 41.3,59.9 41.3,62.89 ISP.5 38.07,62.93 TP12.TP
SCLK
  Top 0.254: ISP.3 44.3,62.43 44.3,55 44.06,54.77 MCU.7 40.38,54.7 R4.1
  Bottom 0.254: ISP.3 42.53,64.2 39.8,64.2 TP11.TP
SCLK-L
  Top 0.254: FMIC.7 31.8,56.15 R8.1 32.85,54.9 R4.2
SDIO
  Top 0.254: MCU.5 | MCU.5 32.45,57.3 R5.1 | MCU.5 39.9,57.85 39.9,63.6 40.5,64.2 42.53,64.2 ISP.4
  Bottom 0.254: TP13.TP 41.27,68 ISP.4
SDIO-L
  Top 0.254: R7.1 R5.2 30.5,56.65 FMIC.8
SPK_OUT+  (via drill 0.6)
  Top 0.254: v24.2,11.1 23.4,11.9
  Top 0.406: FB2.2 25,13.5 23.4,11.9 23.2,11.7 JST_CONN.2
  Bottom 0.254: TP6.TP 25.3,10 v24.2,11.1
SPK_OUT-  (via drill 0.6)
  Top 0.254: v28,4.7 28,5.7
  Top 0.406: FB3.1 29.4,11.3 29,10.9 29,6.4 28.3,5.7 28,5.7 JST_CONN.1
  Bottom 0.254: TP7.TP 28.7,4 v28,4.7
SW  (via drill 0.5, 0.6)
  Top 0.254: MCU.2 48.47,54.77 v49,55.3 54.29,55.3 SW1.P$4 | v49,58.5 49,59.59 SW1.P$3
  Bottom 0.254: v49,55.3 v49,58.5 49,60 TP8.TP
SW_IN
  Top 0.813: FET2.3 R1.SW_IN
  Bottom 0.254: TP14.TP R1.SW_IN
SW_OUT
  Top 0.813: JP5.POS JP5.POS@2 59.38,46.62 R1.SW_OUT
  Bottom 0.254: TP15.TP R1.SW_OUT
VCC  (via drill 0.6)
  Top 0.254: 40.95,53.49 MCU.8 | 39.9,14.1 40,14 | 40.95,53.49 44.4,53.49 44.8,53.9 44.8,59 47.9,62.1 47.9,63.91 ISP.2 | C14.1 C12.1 40.95,52.09 40.95,53.49
  Top 0.406: v39.9,16.1 39.9,14.1
  Top 0.61: R15.1 44.85,53.49 40.95,53.49 | MCU.8 v37.01,53.49 | v37,58.8 35,60.8 L2.1
  Top 0.813: 53.15,22.65 46.8,16.3 45,16.3 C1.P$1 40,14 L3.1 | 53.15,22.65 56.1,25.6 56.1,42.25 48.15,50.2 46.4,50.2 46.35,50.25 R15.1 | 53.15,22.65 56.15,19.65 58.1,19.65 FET2.2
  Bottom 0.406: TP5.TP v37,58.8 | TP4.TP 39,17 v39.9,16.1
  Bottom 0.61: v37.01,53.49 v37,53.5 v37,58.8

### Text on the board
bNames: Board # PR9014 / DVT/DFM Pre-production